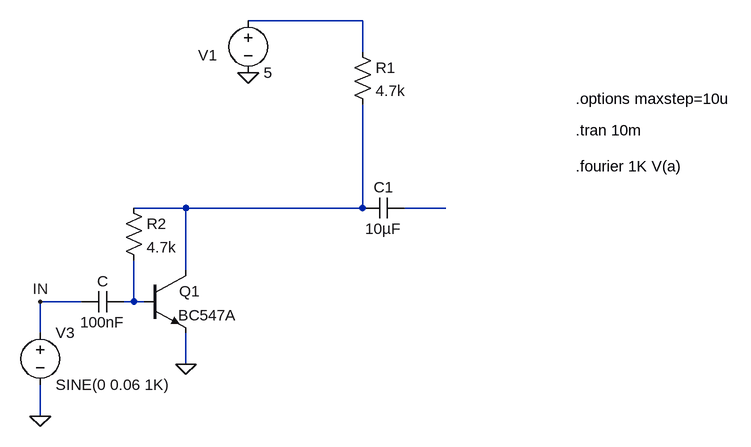
[diagram p0: schematic audioamp.asc]
audioamp.asc, the LTspice schematic file:
Version 4
SHEET 1 2344 2032
WIRE 1056 928 880 928
WIRE 1056 976 1056 928
WIRE 784 1216 704 1216
WIRE 1056 1216 1056 1056
WIRE 1056 1216 784 1216
WIRE 1184 1216 1120 1216
WIRE 784 1312 784 1216
WIRE 624 1360 560 1360
WIRE 704 1360 704 1296
WIRE 704 1360 688 1360
WIRE 720 1360 704 1360
WIRE 560 1408 560 1360
WIRE 784 1456 784 1408
WIRE 560 1536 560 1488
FLAG 784 1456 0
FLAG 560 1536 0
FLAG 560 1360 IN
FLAG 880 1008 0
SYMBOL VOLTAGE 880 912 R0
WINDOW 0 -77 69 Left 2
WINDOW 123 0 0 Left 0
WINDOW 39 0 0 Left 0
SYMATTR InstName V1
SYMATTR Value 5
SYMBOL npn 720 1312 R0
WINDOW 0 54 32 Left 2
WINDOW 3 52 69 Left 2
SYMATTR InstName Q1
SYMATTR Value BC547A
SYMBOL res 688 1200 R0
SYMATTR InstName R2
SYMATTR Value 4.7k
SYMBOL voltage 560 1392 R0
WINDOW 123 0 0 Left 0
WINDOW 39 0 0 Left 0
SYMATTR InstName V3
SYMATTR Value SINE(0 0.06 1K)
SYMBOL cap 688 1344 R90
WINDOW 0 0 32 VBottom 2
WINDOW 3 32 32 VTop 2
SYMATTR InstName C
SYMATTR Value 100nF
SYMBOL res 1040 960 R0
SYMATTR InstName R1
SYMATTR Value 4.7k
SYMBOL cap 1120 1200 R90
WINDOW 0 0 32 VBottom 2
WINDOW 3 32 32 VTop 2
SYMATTR InstName C1
SYMATTR Value 10µF
TEXT 1384 1096 Left 2 !.tran 10m
TEXT 1384 1048 Left 2 !.options maxstep=10u
TEXT 1384 1152 Left 2 !.fourier 1K V(a)

The netlist it stands for:
* audioamp.asc
V1 N001 0 5
Q1 N002 N004 0 0 BC547A
R2 N002 N004 4.7k
V3 IN 0 SINE(0 0.06 1K)
C N004 IN 100nF
R1 N001 N002 4.7k
C1 N003 N002 10µF
.model NPN NPN
.model PNP PNP
.lib standard.bjt
.tran 10m
.options maxstep=10u
.fourier 1K V(a)
.backanno
.end